# EasyEDA Pro project syntheseproject_2025-11-30.epro

# Schematic Schematic1
Board Name: Board1; Create Date: 2025-10-10; Page Name: P1; Project Name: syntheseproject; Schematic Name: Schematic1; Update Date: 2025-11-30; Company: EasyEDA.com; Page Size: A4; Version: V1.0
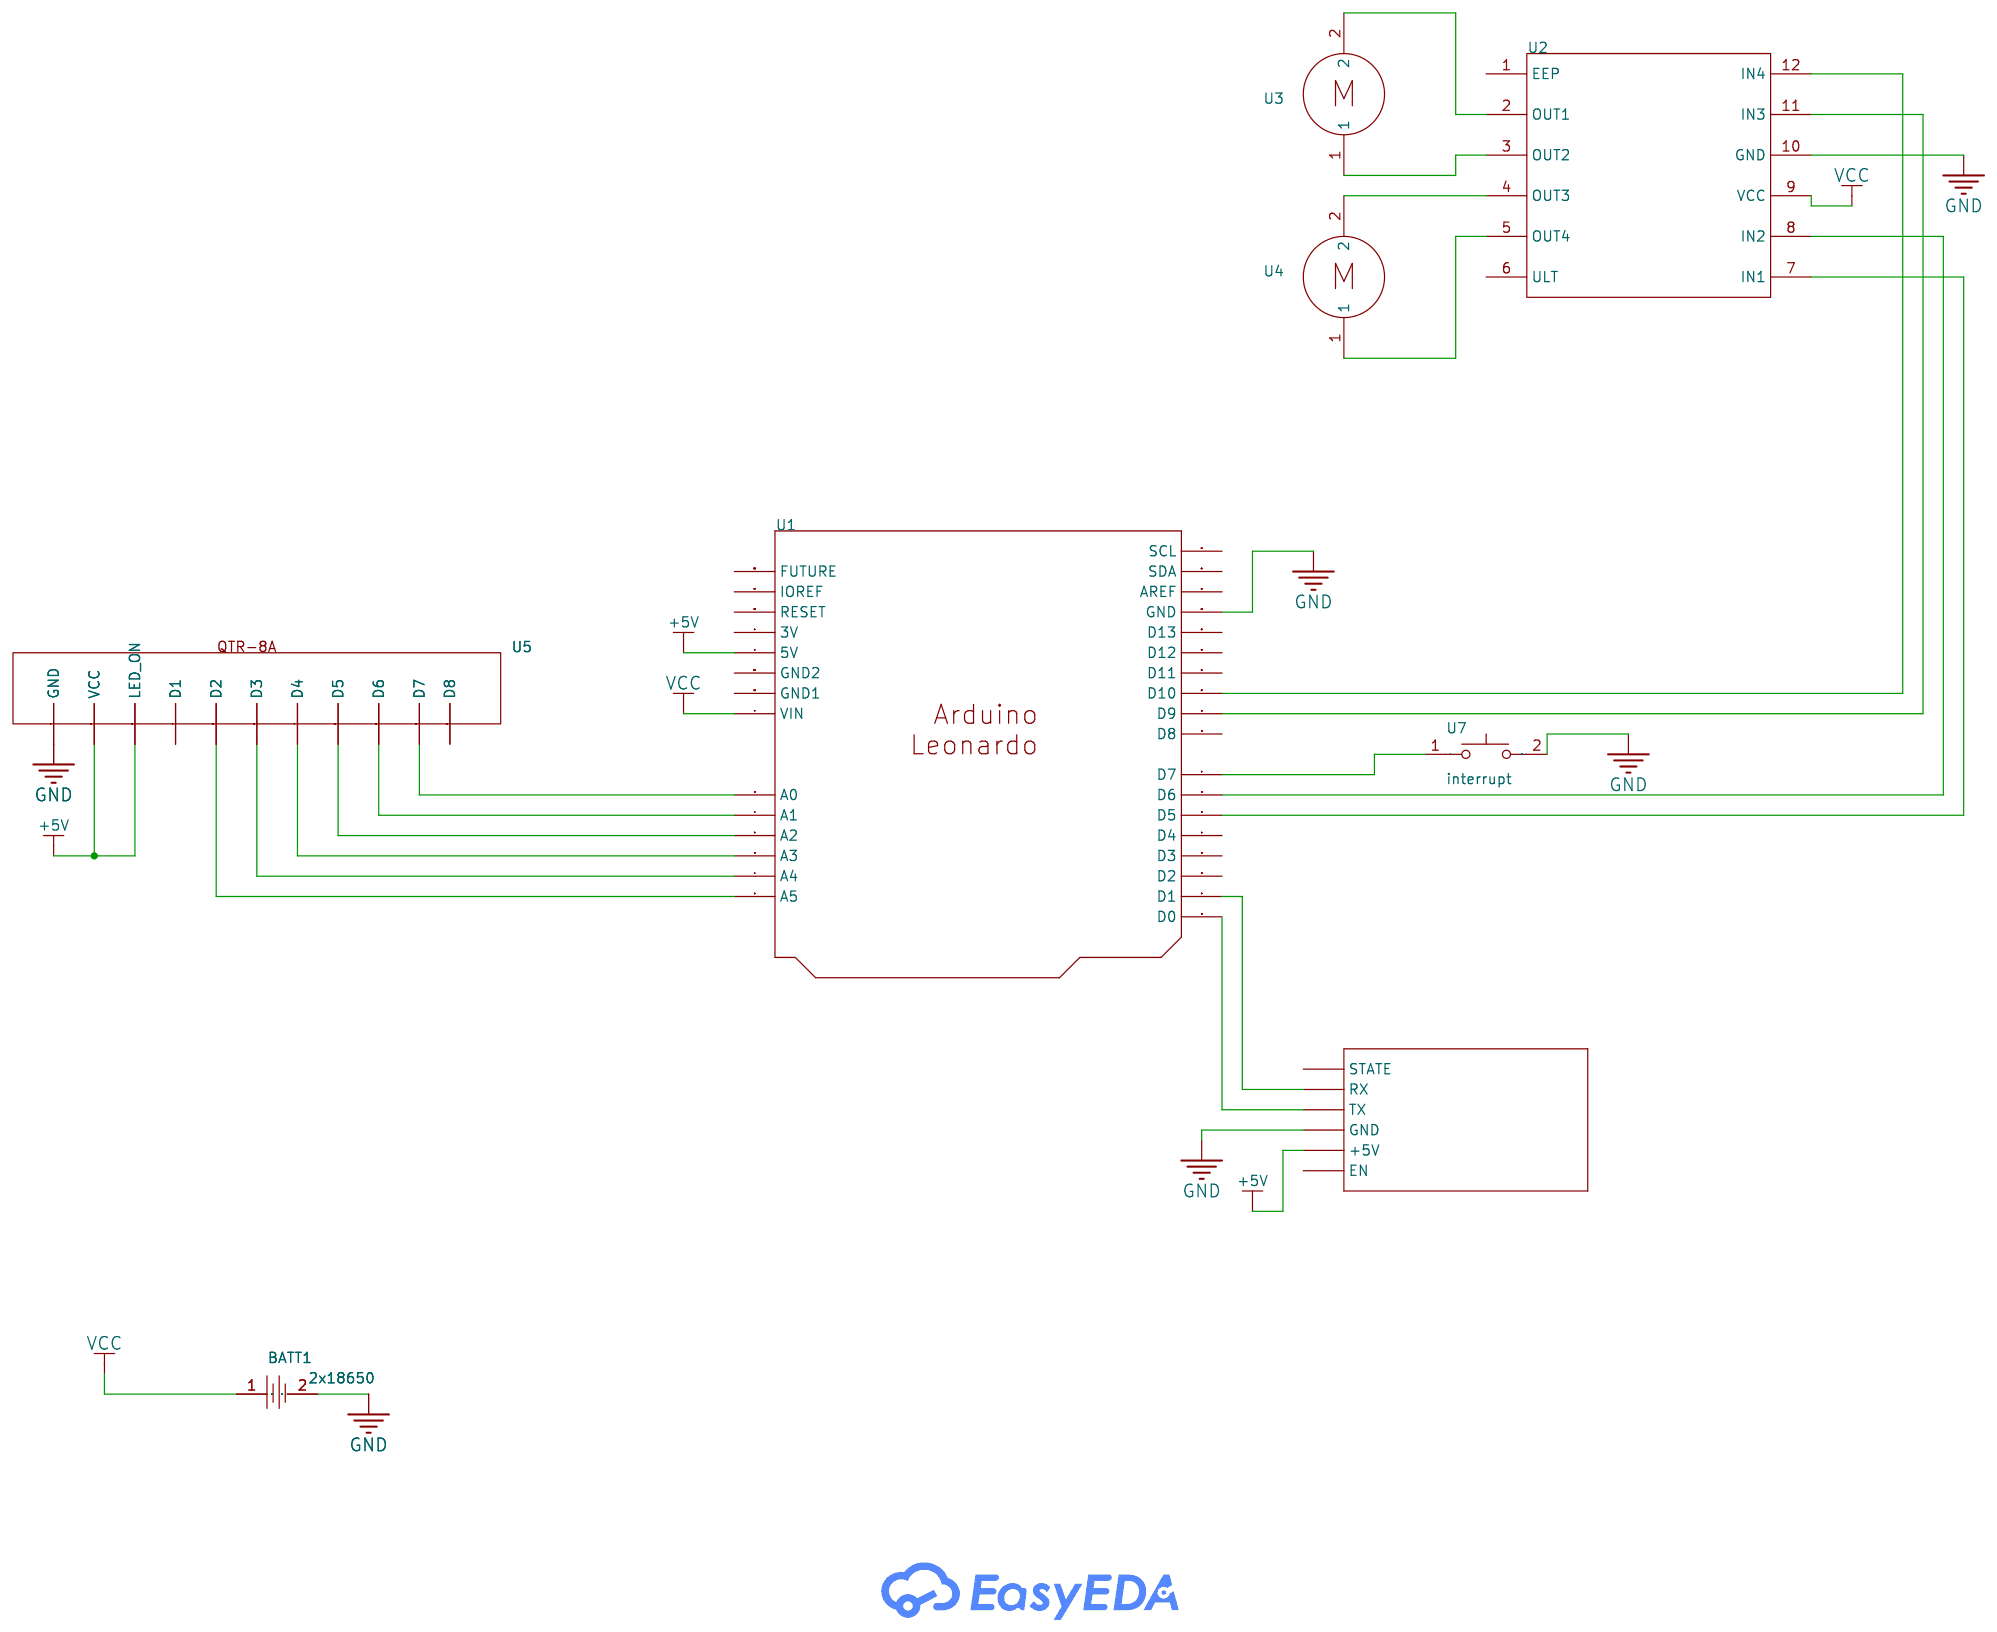
[diagram p0: schematic sheet]

## Parts
?#1  -
BATT1  2x18650
U1  -
U2  -  [DRV8833]
U3  -
U4  -
U5  -
U7  interrupt  [SW-SMD_L6.0-W3.5-LS8.0-1]

## Library data of the parts
?#1 = HC-05: _: 3
BATT1 = BATTERYHOLDER
U1 = Arduino Leonardo
U2 = DRV8833: _: 3
U3 U4 = dc-motor
U5 = QTR-8A
U7 = BUTTON2: Supplier Part: C9900005988; Supplier Footprint: SMD-2_L6.0-W3.5-LS8.0; JLCPCB Part Class: Extended Part; Supplier: LCSC

## Nets
+5V: ?#1.(EN) BATT1.2 U1.5V U1.D0 U1.D1 U1.GND U2.10(GND) U5.1(GND) U5.2(VCC) U5.3(LED ON) U7.2
VCC: BATT1.1 U1.VIN U2.9(VCC)
Net-(U1-A0): U1.A0 U5.10(D7)
Net-(U1-A1): U1.A1 U5.9(D6)
Net-(U1-A2): U1.A2 U5.8(D5)
Net-(U1-A3): U1.A3 U5.7(D4)
Net-(U1-A4): U1.A4 U5.6(D3)
Net-(U1-A5): U1.A5 U5.5(D2)
Net-(U1-D5): U1.D5 U2.7(IN1)
Net-(U1-D6): U1.D6 U2.8(IN2)
Net-(U1-D7): U1.D7 U7.1
Net-(U1-D9): U1.D9 U2.11(IN3)
Net-(U1-D10): U1.D10 U2.12(IN4)
Net-(U2-2): U2.2(OUT1) U3.2
Net-(U2-3): U2.3(OUT2) U3.1
Net-(U2-4): U2.4(OUT3) U4.2
Net-(U2-5): U2.5(OUT4) U4.1

Not connected (* = marked no-connect by the designer): U1 3V AREF D2 D3 D4 D8 D11 D12 D13 GND$2(GND2) GND$3(GND1) IOREF RESERVED(FUTURE) RESET SCL SDA; U2 1(EEP) 6(ULT); U5 4(D1) 11(D8)
